# EAGLE design esq (EAGLE 9.6.2)
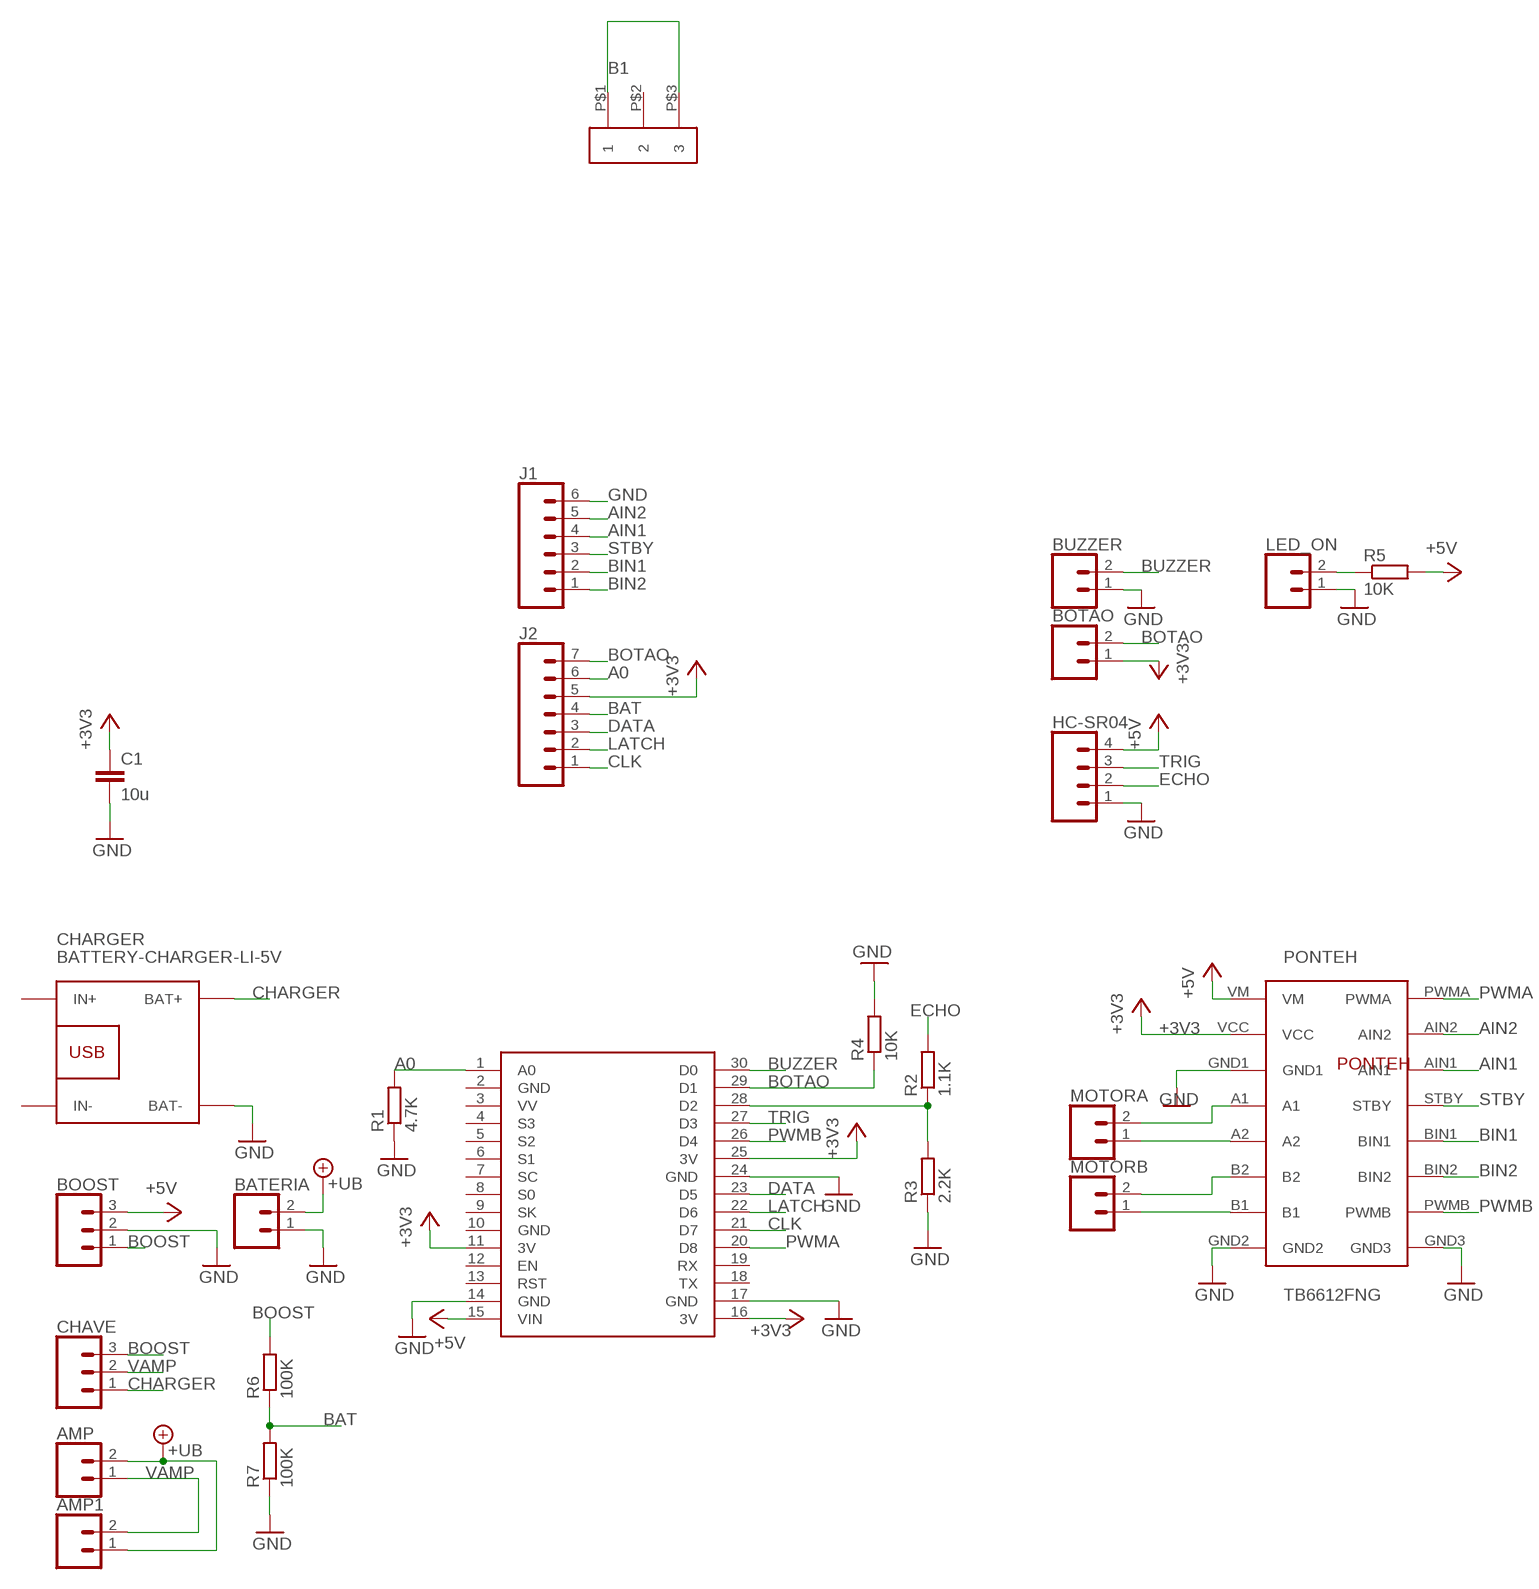
[diagram p0: schematic, sheet 1]

## Parts
AMP  CONN_02  [1X02]
AMP1  CONN_02  [1X02]
B1  BOCAL  [BOCAL]
BATERIA  CONN_02  [1X02]
BOOST  CONN_03  [1X03]
BOTAO  CONN_02  [1X02]
BUZZER  CONN_02  [1X02]
C1  10u  C2,5-3  [C2.5-3]
CHARGER  BATTERY-CHARGER-LI-5V  [BATTERY-CHARGER-LI-5V]
CHAVE  CONN_03  [1X03]
HC-SR04  CONN_04  [1X04]
J1  CONN_06SILK_FEMALE_PTH  [1X06]
J2  CONN_07  [1X07]
LED_ON  CONN_02  [1X02]
MOTORA  CONN_02  [1X02]
MOTORB  CONN_02  [1X02]
NODEMCU  NODEMCU  [NODEMCU]
PONTEH  TB6612FNG  [TB6612FNG]
R1  4.7K  R-EU_0204/7  [0204/7]
R2  1.1K  R-EU_0204/7  [0204/7]
R3  2.2K  R-EU_0204/7  [0204/7]
R4  10K  R-EU_0204/7  [0204/7]
R5  10K  R-EU_0204/7  [0204/7]
R6  100K  R-EU_0204/7  [0204/7]
R7  100K  R-EU_0204/7  [0204/7]

## Nets
+3V3: BOTAO.1 C1.1 J2.5 NODEMCU.11(3V) NODEMCU.16(3V) NODEMCU.25(3V) PONTEH.VCC
+5V: BOOST.3 HC-SR04.4 NODEMCU.15(VIN) PONTEH.VM R5.2
+UB: AMP1.1 AMP.2 BATERIA.2
A0: J2.6 NODEMCU.1(A0) R1.2
AIN1: J1.4 PONTEH.AIN1
AIN2: J1.5 PONTEH.AIN2
BAT: J2.4 R6.1 R7.2
BIN1: J1.2 PONTEH.BIN1
BIN2: J1.1 PONTEH.BIN2
BOOST: BOOST.1 CHAVE.3 R6.2
BOTAO: BOTAO.2 J2.7 NODEMCU.29(D1) R4.1
BUZZER: BUZZER.2 NODEMCU.30(D0)
CHARGER: CHARGER.BAT+ CHAVE.1
CLK: J2.1 NODEMCU.21(D7)
DATA: J2.3 NODEMCU.23(D5)
ECHO: HC-SR04.2 R2.2
GND: BATERIA.1 BOOST.2 BUZZER.1 C1.2 CHARGER.BAT- HC-SR04.1 J1.6 LED_ON.1 NODEMCU.14(GND) NODEMCU.17(GND) NODEMCU.24(GND) PONTEH.GND1 PONTEH.GND2 PONTEH.GND3 R1.1 R3.1 R4.2 R7.1
LATCH: J2.2 NODEMCU.22(D6)
N$1: MOTORA.2 PONTEH.A1
N$2: MOTORA.1 PONTEH.A2
N$3: MOTORB.2 PONTEH.B2
N$4: MOTORB.1 PONTEH.B1
N$5: LED_ON.2 R5.1
N$6: B1.P$1 B1.P$3
N$39: NODEMCU.28(D2) R2.1 R3.2
PWMA: NODEMCU.20(D8) PONTEH.PWMA
PWMB: NODEMCU.26(D4) PONTEH.PWMB
STBY: J1.3 PONTEH.STBY
TRIG: HC-SR04.3 NODEMCU.27(D3)
VAMP: AMP1.2 AMP.1 CHAVE.2
Unconnected: B1.P$2 CHARGER.IN+ CHARGER.IN- NODEMCU.3(VV) NODEMCU.4(S3) NODEMCU.5(S2) NODEMCU.6(S1) NODEMCU.7(SC) NODEMCU.8(S0) NODEMCU.9(SK) NODEMCU.12(EN) NODEMCU.13(RST) NODEMCU.18(TX) NODEMCU.19(RX)

## Power pins joined to a net without a drawn wire
GND: NODEMCU.2(GND) NODEMCU.10(GND)

## Library data of the parts
AMP AMP1 BATERIA BOTAO BUZZER LED_ON MOTORA MOTORB = SparkFun-Connectors:CONN_02: Multi connection point. Often used as Generic Header-pin footprint for 0.1 inch spaced/style header connections On any of the 0.1 inch spaced packages, you can populate with these: Break Away Headers - Straight <https://www.sparkfun.com/products/116> (PRT-00116) Break Away Male Headers - Right Angle <https://www.sparkfun.com/products/553> (PRT-00553) Female Headers <https://www.sparkfun.com/products/115> (PRT-00115) Break Away Headers - Machine Pin <https://www.sparkfun.com/products/117> (PRT-00117) Break Away Female Headers - Swiss Machine Pin <https://www.sparkfun.com/products/743> (PRT-00743) For SCREWTERMINALS and SPRING TERMINALS visit here: Screw Terimnals on SparkFun.com <https://www.sparkfun.com/search/results?term=Screw+Terminals> (5mm/3.5mm/2.54mm spacing) This device is also useful as a general connection point to wire up your design to another part of your project. Our various solder wires solder well into these plated through hole pads. Hook-Up Wire - Assortment (Stranded, 22 AWG) <https://www.sparkfun.com/products/11375> (PRT-11375) Hook-Up Wire - Assortment (Solid Core, 22 AWG) <https://www.sparkfun.com/products/11367> (PRT-11367) View the entire wire category on our website here <https://www.sparkfun.com/categories/141> Special notes: Molex polarized connector foot print use with: PRT-08233 with associated crimp pins and housings. 2.54_SCREWTERM for use with PRT-10571. 3.5mm Screw Terminal footprints for PRT-08084 5mm Screw Terminal footprints for use with PRT-08432
B1 = myLib:BOCAL: Defines a base connector for Tampi.
BOOST CHAVE = SparkFun-Connectors:CONN_03: Multi connection point. Often used as Generic Header-pin footprint for 0.1 inch spaced/style header connections On any of the 0.1 inch spaced packages, you can populate with these: Break Away Headers - Straight <https://www.sparkfun.com/products/116> (PRT-00116) Break Away Male Headers - Right Angle <https://www.sparkfun.com/products/553> (PRT-00553) Female Headers <https://www.sparkfun.com/products/115> (PRT-00115) Break Away Headers - Machine Pin <https://www.sparkfun.com/products/117> (PRT-00117) Break Away Female Headers - Swiss Machine Pin <https://www.sparkfun.com/products/743> (PRT-00743) Stackable Header - 3 Pin (Female, 0.1") <https://www.sparkfun.com/products/13875> (PRT-13875) For SCREWTERMINALS and SPRING TERMINALS visit here: Screw Terimnals on SparkFun.com <https://www.sparkfun.com/search/results?term=Screw+Terminals> (5mm/3.5mm/2.54mm spacing) This device is also useful as a general connection point to wire up your design to another part of your project. Our various solder wires solder well into these plated through hole pads. Hook-Up Wire - Assortment (Stranded, 22 AWG) <https://www.sparkfun.com/products/11375> (PRT-11375) Hook-Up Wire - Assortment (Solid Core, 22 AWG) <https://www.sparkfun.com/products/11367> (PRT-11367) View the entire wire category on our website here <https://www.sparkfun.com/categories/141> Special notes: Molex polarized connector foot print use with SKU : PRT-08232 with associated crimp pins and housings.
C1 = capacitor-wima:C: CAPACITOR naming: grid - package width
CHARGER = diy-modules:BATTERY-CHARGER-LI-5V: Lithium Battery 5V Charger More details available here: http://www.buildcircuit.com/how-to-use-micro-usb-5v-1a-lithium-battery-charging-board-charger-module/ Click here to find device on ebay.com <http://www.ebay.com/sch/tp4056+charger+usb>
HC-SR04 = SparkFun-Connectors:CONN_04: Multi connection point. Often used as Generic Header-pin footprint for 0.1 inch spaced/style header connections On any of the 0.1 inch spaced packages, you can populate with these: Break Away Headers - Straight <https://www.sparkfun.com/products/116> (PRT-00116) Break Away Male Headers - Right Angle <https://www.sparkfun.com/products/553> (PRT-00553) Female Headers <https://www.sparkfun.com/products/115> (PRT-00115) Break Away Headers - Machine Pin <https://www.sparkfun.com/products/117> (PRT-00117) Break Away Female Headers - Swiss Machine Pin <https://www.sparkfun.com/products/743> (PRT-00743) For SCREWTERMINALS and SPRING TERMINALS visit here: Screw Terimnals on SparkFun.com <https://www.sparkfun.com/search/results?term=Screw+Terminals> (5mm/3.5mm/2.54mm spacing) This device is also useful as a general connection point to wire up your design to another part of your project. Our various solder wires solder well into these plated through hole pads. Hook-Up Wire - Assortment (Stranded, 22 AWG) <https://www.sparkfun.com/products/11375> (PRT-11375) Hook-Up Wire - Assortment (Solid Core, 22 AWG) <https://www.sparkfun.com/products/11367> (PRT-11367) View the entire wire category on our website here <https://www.sparkfun.com/categories/141> Special notes: Molex polarized connector foot print use with SKU : PRT-08231 with associated crimp pins and housings. 1MM SMD Version SKU: PRT-10208; PROD_ID: CONN-09696
J1 = SparkFun-Connectors:CONN_06: Multi connection point. Often used as Generic Header-pin footprint for 0.1 inch spaced/style header connections On any of the 0.1 inch spaced packages, you can populate with these: Break Away Headers - Straight <https://www.sparkfun.com/products/116> (PRT-00116) Break Away Male Headers - Right Angle <https://www.sparkfun.com/products/553> (PRT-00553) Female Headers <https://www.sparkfun.com/products/115> (PRT-00115) Break Away Headers - Machine Pin <https://www.sparkfun.com/products/117> (PRT-00117) Break Away Female Headers - Swiss Machine Pin <https://www.sparkfun.com/products/743> (PRT-00743) Arduino Stackable Header - 6 Pin <https://www.sparkfun.com/products/9280> (PRT-09280) For SCREWTERMINALS and SPRING TERMINALS visit here: Screw Terimnals on SparkFun.com <https://www.sparkfun.com/search/results?term=Screw+Terminals> (5mm/3.5mm/2.54mm spacing) This device is also useful as a general connection point to wire up your design to another part of your project. Our various solder wires solder well into these plated through hole pads. Hook-Up Wire - Assortment (Stranded, 22 AWG) <https://www.sparkfun.com/products/11375> (PRT-11375) Hook-Up Wire - Assortment (Solid Core, 22 AWG) <https://www.sparkfun.com/products/11367> (PRT-11367) View the entire wire category on our website here <https://www.sparkfun.com/categories/141>; PROD_ID: CONN-08437
J2 = SparkFun-Connectors:CONN_07: Multi connection point. Often used as Generic Header-pin footprint for 0.1 inch spaced/style header connections On any of the 0.1 inch spaced packages, you can populate with these: Break Away Headers - Straight <https://www.sparkfun.com/products/116> (PRT-00116) Break Away Male Headers - Right Angle <https://www.sparkfun.com/products/553> (PRT-00553) Female Headers <https://www.sparkfun.com/products/115> (PRT-00115) Break Away Headers - Machine Pin <https://www.sparkfun.com/products/117> (PRT-00117) Break Away Female Headers - Swiss Machine Pin <https://www.sparkfun.com/products/743> (PRT-00743) For SCREWTERMINALS and SPRING TERMINALS visit here: Screw Terimnals on SparkFun.com <https://www.sparkfun.com/search/results?term=Screw+Terminals> (5mm/3.5mm/2.54mm spacing) This device is also useful as a general connection point to wire up your design to another part of your project. Our various solder wires solder well into these plated through hole pads. Hook-Up Wire - Assortment (Stranded, 22 AWG) <https://www.sparkfun.com/products/11375> (PRT-11375) Hook-Up Wire - Assortment (Solid Core, 22 AWG) <https://www.sparkfun.com/products/11367> (PRT-11367) View the entire wire category on our website here <https://www.sparkfun.com/categories/141> Special notes: Molex polarized connector foot print use with SKU : PRT-08231 with associated crimp pins and housings. 1MM SMD Version SKU: PRT-10208 NOTES ON THE VARIANTS LOCK and LOCK_LONGPADS... This footprint was designed to help hold the alignment of a through-hole component (i.e. 6-pin header) while soldering it into place. You may notice that each hole has been shifted either up or down by 0.005 of an inch from it's more standard position (which is a perfectly straight line). This slight alteration caused the pins (the squares in the middle) to touch the edges of the holes. Because they are alternating, it causes a "brace" to hold the component in place. 0.005 has proven to be the perfect amount of "off-center" position when using our standard breakaway headers. Although looks a little odd when you look at the bare footprint, once you have a header in there, the alteration is very hard to notice. Also,if you push a header all the way into place, it is covered up entirely on the bottom side.
NODEMCU = nodemcu:NODEMCU
PONTEH = TB6612FNG:TB6612FNG
R1-R7 = rcl:R-EU_: RESISTOR, European symbol; SPICEPREFIX: R

## Board
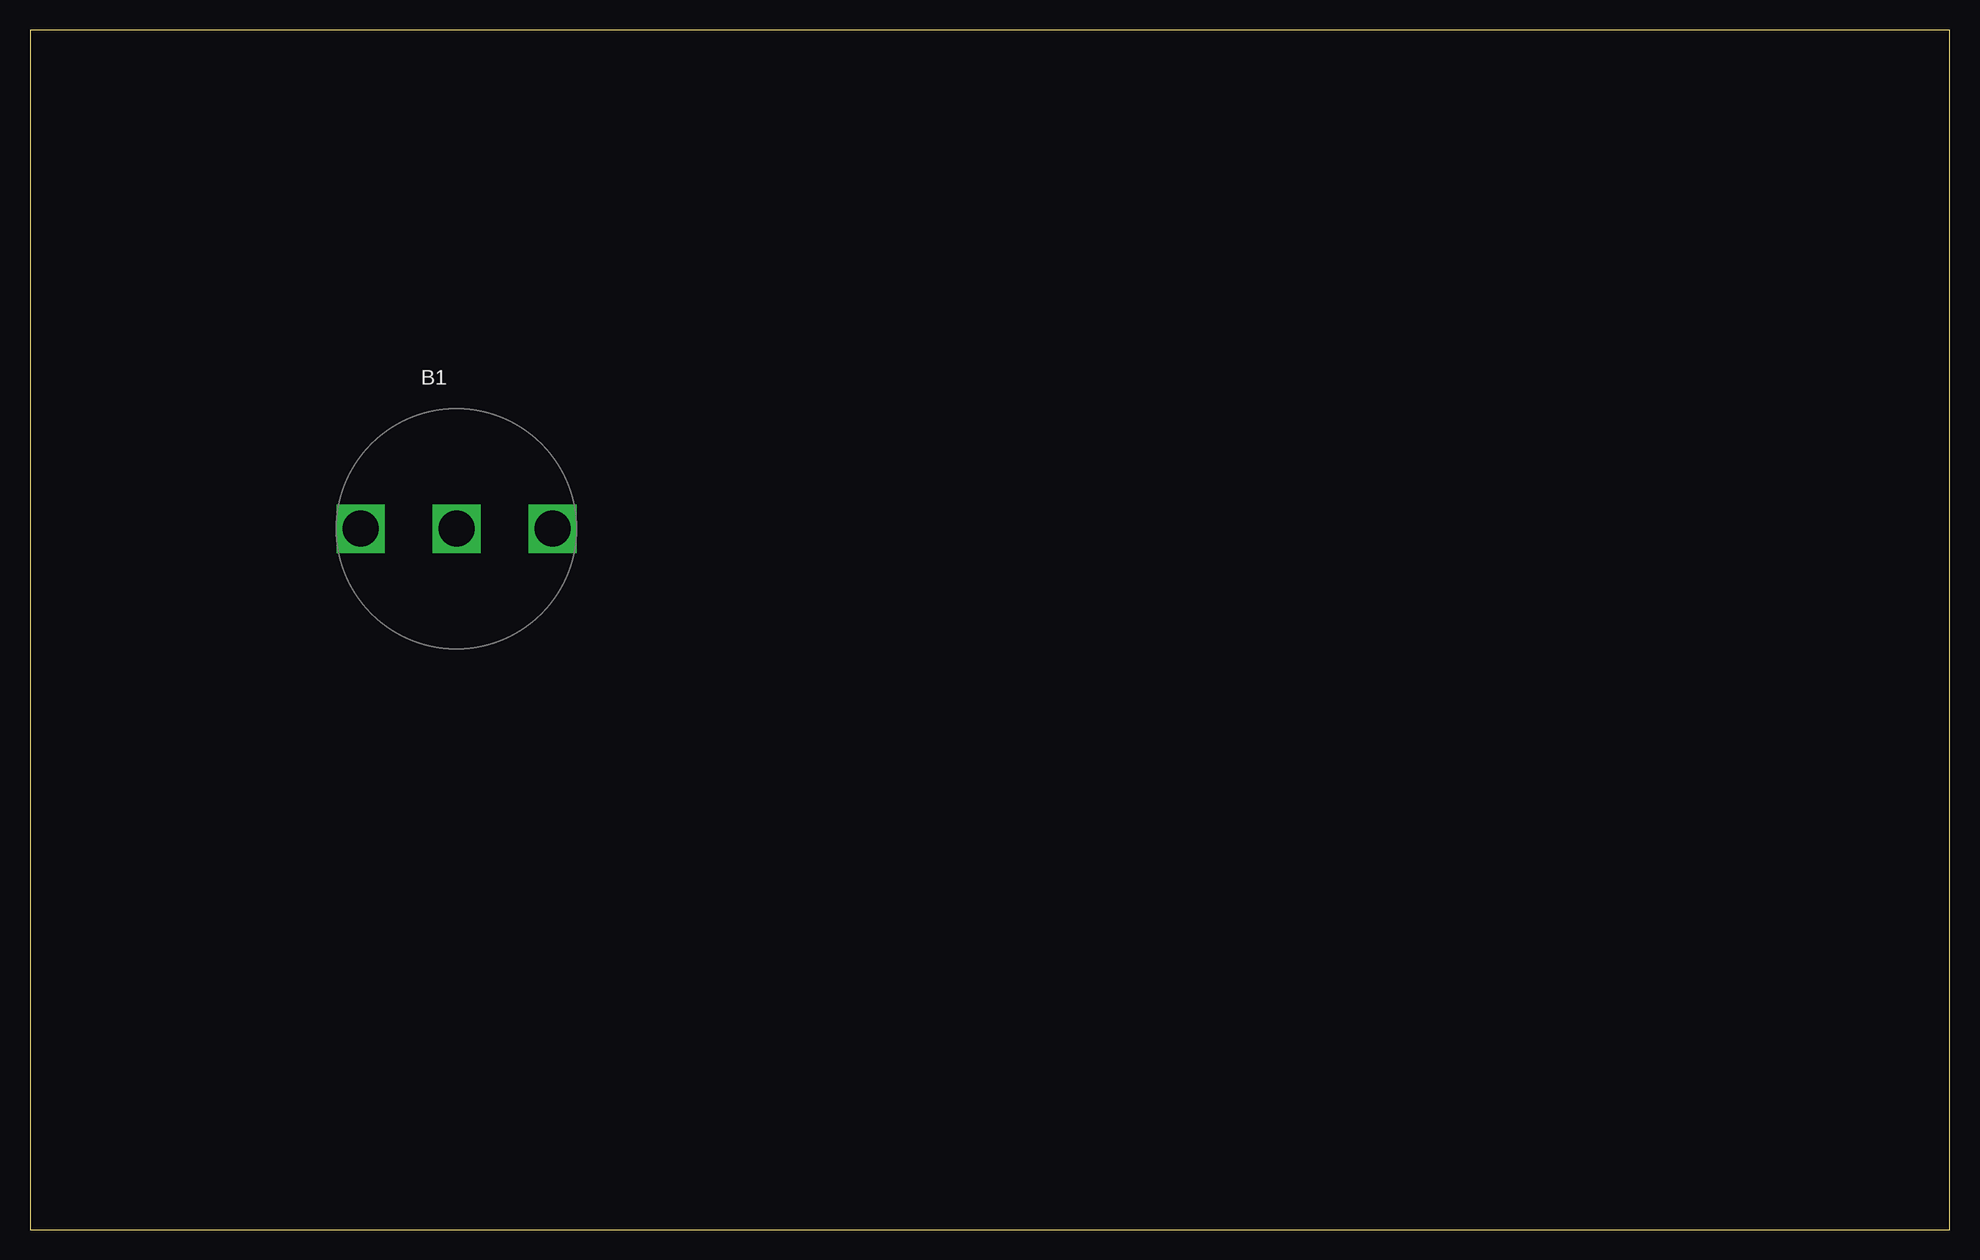
[diagram p1: board, top side]
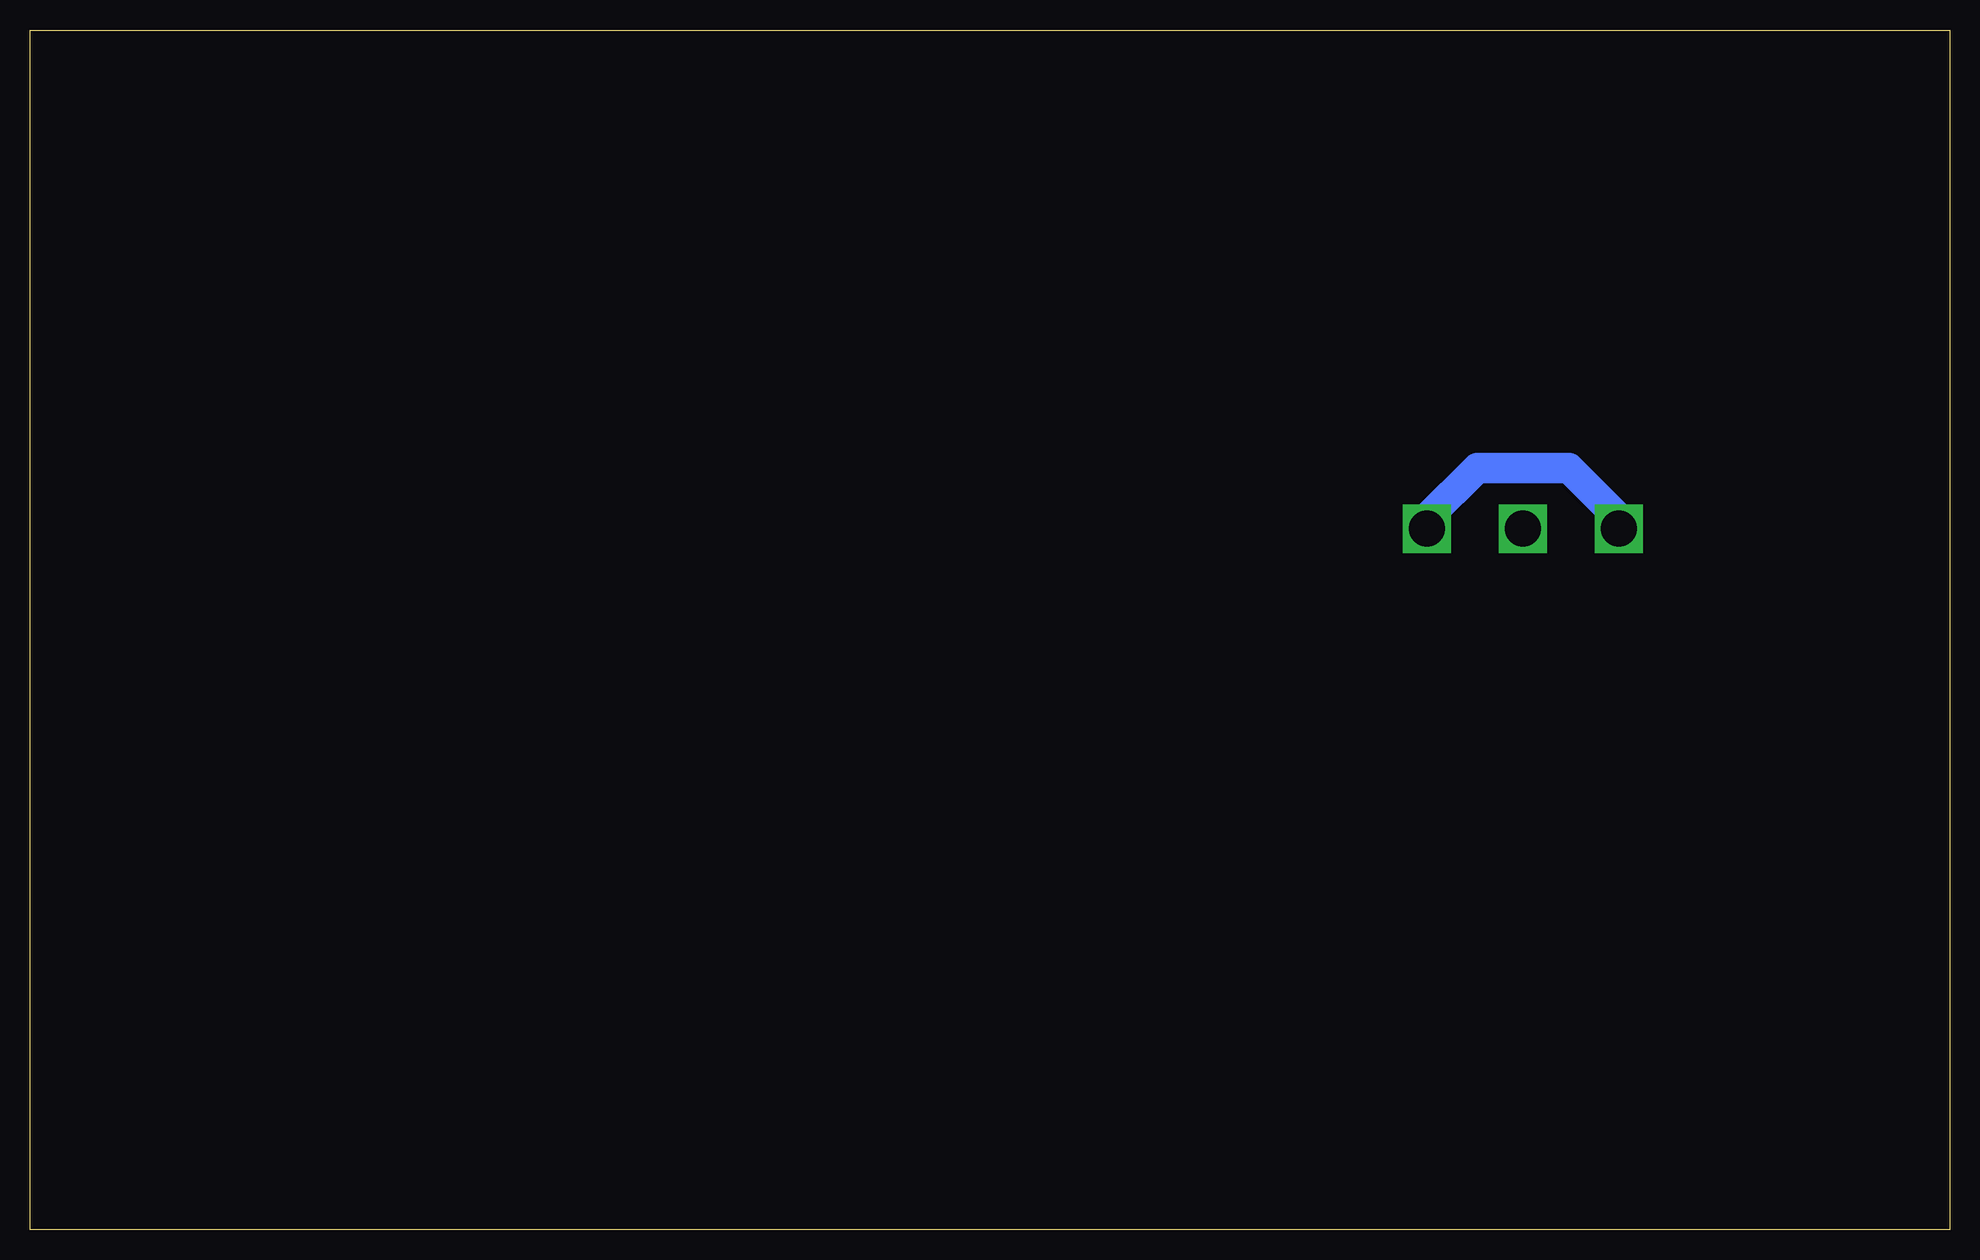
[diagram p2: board, bottom side, seen from below]

Size 160 x 100 mm. Coordinates in mm from the lower left corner, seen from the top.
Outline: 0,0 160,0 160,100 0,100 0,0
Copper layers (1*16): Top 0.035mm / dielectric 1.5mm / Bottom 0.035mm
Design rules "default": minimum track width 6mil, minimum drill 0.35mm, track to track 6mil, track to pad 6mil, pad to pad 6mil, via to via 6mil, smd to smd 6mil, copper to edge 40mil, drill to drill 6mil, minimum pad ring 10mil, minimum via ring 8mil, stop-mask expansion 4mil, vias tented up to drill 0mil, thermal gap 10mil

### Footprints (pad centres in the part's own frame; a part is rotated, then mirrored left to right if it is on the bottom)
1X02 = drill 1.016 pad 1.88: 1 0,0; 2 2.54,0
BOCAL = drill 3 square: P$1 -8,0; P$2 0,0; P$3 8,0
1X03 = drill 1.016 pad 1.88: 1 0,0; 2 2.54,0; 3 5.08,0
C2.5-3 = drill 0.813 pad 1.6 octagon: 1 -1.27,0; 2 1.27,0
BATTERY-CHARGER-LI-5V = drill 1.2 pad 3 square: BAT+ 10.795,8.255; BAT- 10.795,-7.62; IN+ -10.795,8.255; IN- -10.795,-7.62
1X04 = drill 1.016 pad 1.88: 1 0,0; 2 2.54,0; 3 5.08,0; 4 7.62,0
1X06 = drill 1.016 pad 1.88: 1 0,0; 2 2.54,0; 3 5.08,0; 4 7.62,0; 5 10.16,0; 6 12.7,0
1X07 = drill 1.016 pad 1.88: 1 0,0; 2 2.54,0; 3 5.08,0; 4 7.62,0; 5 10.16,0; 6 12.7,0; 7 15.24,0
NODEMCU = drill 1 pad 1.676 long: 1 -13.97,17.78; 2 -13.97,15.24; 3 -13.97,12.7; 4 -13.97,10.16; 5 -13.97,7.62; 6 -13.97,5.08; 7 -13.97,2.54; 8 -13.97,0; 9 -13.97,-2.54; 10 -13.97,-5.08; 11 -13.97,-7.62; 12 -13.97,-10.16; 13 -13.97,-12.7; 14 -13.97,-15.24; 15 -13.97,-17.78; 16 13.97,-17.78; 17 13.97,-15.24; 18 13.97,-12.7; 19 13.97,-10.16; 20 13.97,-7.62; 21 13.97,-5.08; 22 13.97,-2.54; 23 13.97,0; 24 13.97,2.54; 25 13.97,5.08; 26 13.97,7.62; 27 13.97,10.16; 28 13.97,12.7; 29 13.97,15.24; 30 13.97,17.78
TB6612FNG = drill 0.6 pad 1.676: A1 -7.62,-1.27; A2 -7.62,-3.81; AIN1 7.874,1.27; AIN2 7.874,3.81; B1 -7.62,-8.89; B2 -7.62,-6.35; BIN1 7.874,-3.81; BIN2 7.874,-6.35; GND1 -7.62,1.27; GND2 -7.62,-11.43; GND3 7.874,-11.43; PWMA 7.874,6.35; PWMB 7.874,-8.89; STBY 7.874,-1.27; VCC -7.62,3.81 | drill 0.7 pad 1.676 square: VM -7.62,6.35
0204/7 = drill 0.813 octagon: 1 -3.81,0; 2 3.81,0

### Placement (x,y rotation side)
AMP  -17.78,99.06 0 top  (outside the outline)
AMP1  -24.13,99.06 0 top  (outside the outline)
B1  35.56,58.42 0 top
BATERIA  -30.48,99.06 0 top  (outside the outline)
BOOST  -67.31,95.25 0 top  (outside the outline)
BOTAO  -36.83,99.06 0 top  (outside the outline)
BUZZER  -43.18,99.06 0 top  (outside the outline)
C1  -64.77,66.04 0 top  (outside the outline)
CHARGER  -26.67,74.93 0 top  (outside the outline)
CHAVE  -76.2,95.25 0 top  (outside the outline)
HC-SR04  -58.42,95.25 0 top  (outside the outline)
J1  -46.99,95.25 0 top  (outside the outline)
J2  -30.48,95.25 0 top  (outside the outline)
LED_ON  -49.53,99.06 0 top  (outside the outline)
MOTORA  -55.88,99.06 0 top  (outside the outline)
MOTORB  -62.23,99.06 0 top  (outside the outline)
NODEMCU  -29.21,31.75 0 top  (outside the outline)
PONTEH  -54.61,16.51 0 top  (outside the outline)
R1  -72.39,63.5 0 top  (outside the outline)
R2  -17.78,90.17 0 top  (outside the outline)
R3  -27.94,90.17 0 top  (outside the outline)
R4  -38.1,90.17 0 top  (outside the outline)
R5  -48.26,90.17 0 top  (outside the outline)
R6  -58.42,90.17 0 top  (outside the outline)
R7  -68.58,90.17 0 top  (outside the outline)

### Tracks (layer width: path | path; a pad name or v marks a point on that pad's centre or on a via)
+3V3  (6 unrouted)
+5V  (4 unrouted)
+UB  (2 unrouted)
A0  (2 unrouted)
AIN1  (1 unrouted)
AIN2  (1 unrouted)
BAT  (2 unrouted)
BIN1  (1 unrouted)
BIN2  (1 unrouted)
BOOST  (2 unrouted)
BOTAO  (3 unrouted)
BUZZER  (1 unrouted)
CHARGER  (1 unrouted)
CLK  (1 unrouted)
DATA  (1 unrouted)
ECHO  (1 unrouted)
GND  (19 unrouted)
LATCH  (1 unrouted)
N$1  (1 unrouted)
N$2  (1 unrouted)
N$3  (1 unrouted)
N$4  (1 unrouted)
N$5  (1 unrouted)
N$6
  Bottom 2.54: B1.P$1 27.94,58.8 27.94,59.69 31.75,63.5 39.37,63.5 43.56,59.31 B1.P$3
N$39  (2 unrouted)
PWMA  (1 unrouted)
PWMB  (1 unrouted)
STBY  (1 unrouted)
TRIG  (1 unrouted)
VAMP  (2 unrouted)